# EAGLE schematic uart (EAGLE 6.6.0)
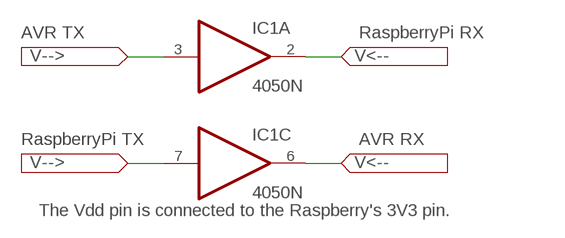
[diagram p0: schematic, sheet 1]

## Parts
IC1  4050N  [DIL16]

## Nets
N$1: IC1.3(A:I)
N$2: IC1.7(C:I)
N$3: IC1.2(A:O)
N$4: IC1.6(C:O)
Unconnected: IC1.4(B:O) IC1.5(B:I) IC1.9(D:I) IC1.10(D:O) IC1.11(E:I) IC1.12(E:O) IC1.14(F:I) IC1.15(F:O)

## Notes on the sheet
- AVR TX | RaspberryPi RX
- RaspberryPi TX | AVR RX
- The Vdd pin is connected to the Raspberry's 3V3 pin.

## Power pins joined to a net without a drawn wire
VDD: IC1.1(P:VDD)
VSS: IC1.8(P:VSS)

## Library data of the parts
IC1 = 40xx:4050: Hex non-inverting BUFFER